# EAGLE design air (EAGLE 9.5.2)
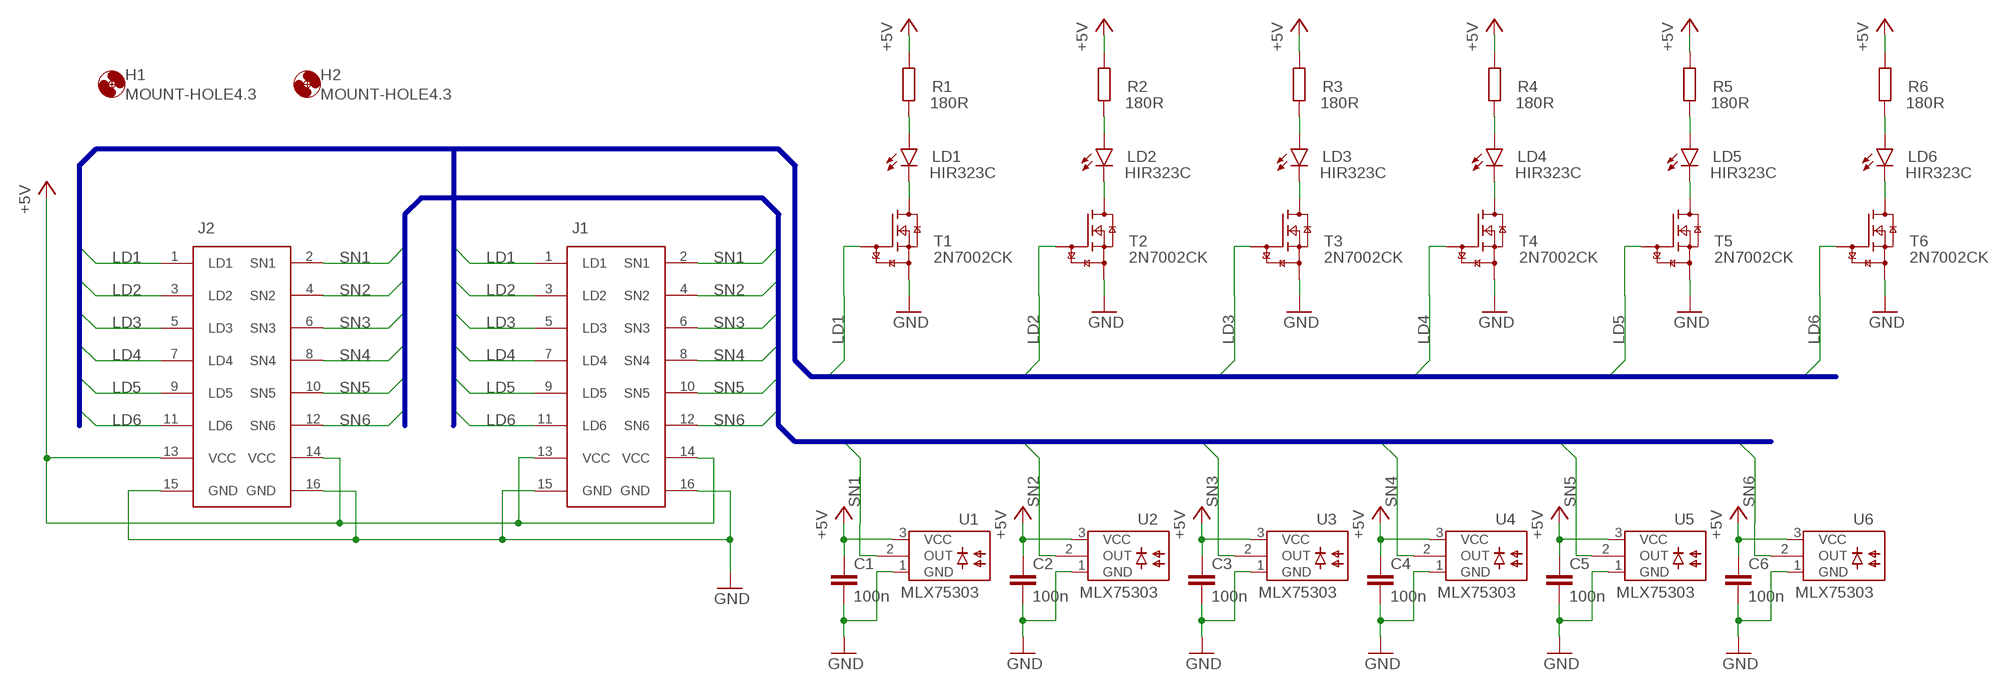
[diagram p0: schematic, sheet 1]

## Parts
C1  100n  C-EUC0805K  [C0805K]
C2  100n  C-EUC0805K  [C0805K]
C3  100n  C-EUC0805K  [C0805K]
C4  100n  C-EUC0805K  [C0805K]
C5  100n  C-EUC0805K  [C0805K]
C6  100n  C-EUC0805K  [C0805K]
H1  MOUNT-HOLE4.3  [4,3]
H2  MOUNT-HOLE4.3  [4,3]
J1  2516-SMD-AIR  [612X1620621]
J2  2516-SMD-AIR  [612X1620621]
LD1  HIR323C  [LEDRD254W60D590H600B]
LD2  HIR323C  [LEDRD254W60D590H600B]
LD3  HIR323C  [LEDRD254W60D590H600B]
LD4  HIR323C  [LEDRD254W60D590H600B]
LD5  HIR323C  [LEDRD254W60D590H600B]
LD6  HIR323C  [LEDRD254W60D590H600B]
R1  180R  R-EU_R0805  [R0805]
R2  180R  R-EU_R0805  [R0805]
R3  180R  R-EU_R0805  [R0805]
R4  180R  R-EU_R0805  [R0805]
R5  180R  R-EU_R0805  [R0805]
R6  180R  R-EU_R0805  [R0805]
T1  2N7002CK  [SOT23]
T2  2N7002CK  [SOT23]
T3  2N7002CK  [SOT23]
T4  2N7002CK  [SOT23]
T5  2N7002CK  [SOT23]
T6  2N7002CK  [SOT23]
U1  MLX75303  [SOIC127P600X147-8N]
U2  MLX75303  [SOIC127P600X147-8N]
U3  MLX75303  [SOIC127P600X147-8N]
U4  MLX75303  [SOIC127P600X147-8N]
U5  MLX75303  [SOIC127P600X147-8N]
U6  MLX75303  [SOIC127P600X147-8N]

## Nets
+5V: C1.1 C2.1 C3.1 C4.1 C5.1 C6.1 J1.13(VCC) J1.14(VCC) J2.13(VCC) J2.14(VCC) R1.2 R2.2 R3.2 R4.2 R5.2 R6.2 U1.3(VCC) U2.3(VCC) U3.3(VCC) U4.3(VCC) U5.3(VCC) U6.3(VCC)
GND: C1.2 C2.2 C3.2 C4.2 C5.2 C6.2 J1.15(GND) J1.16(GND) J2.15(GND) J2.16(GND) T1.2(S) T2.2(S) T3.2(S) T4.2(S) T5.2(S) T6.2(S) U1.1(GND) U2.1(GND) U3.1(GND) U4.1(GND) U5.1(GND) U6.1(GND)
LD1: J1.1(LD1) J2.1(LD1) T1.1(G)
LD2: J1.3(LD2) J2.3(LD2) T2.1(G)
LD3: J1.5(LD3) J2.5(LD3) T3.1(G)
LD4: J1.7(LD4) J2.7(LD4) T4.1(G)
LD5: J1.9(LD5) J2.9(LD5) T5.1(G)
LD6: J1.11(LD6) J2.11(LD6) T6.1(G)
N$1: LD1.1(A) R1.1
N$2: LD1.2(C) T1.3(D)
N$3: LD2.1(A) R2.1
N$4: LD2.2(C) T2.3(D)
N$5: LD3.1(A) R3.1
N$6: LD3.2(C) T3.3(D)
N$7: LD4.1(A) R4.1
N$8: LD4.2(C) T4.3(D)
N$9: LD5.1(A) R5.1
N$10: LD5.2(C) T5.3(D)
N$11: LD6.1(A) R6.1
N$12: LD6.2(C) T6.3(D)
SN1: J1.2(SN1) J2.2(SN1) U1.2(OUT)
SN2: J1.4(SN2) J2.4(SN2) U2.2(OUT)
SN3: J1.6(SN3) J2.6(SN3) U3.2(OUT)
SN4: J1.8(SN4) J2.8(SN4) U4.2(OUT)
SN5: J1.10(SN5) J2.10(SN5) U5.2(OUT)
SN6: J1.12(SN6) J2.12(SN6) U6.2(OUT)

## Buses
SN[1..6]
LD[1..6]

## Library data of the parts
C1-C6 = chuni:C-EU: CAPACITOR, European symbol; SPICEPREFIX: C
H1 H2 = chuni:MOUNT-HOLE: MOUNTING HOLE with drill center marker
J1 J2 = chuni:2516-SMD-AIR: WR-BHD 2.54mm Male SMT Box Header High Temperature, 16 Pins=>Code : Con_WTB_BHD_2.54_Male_SMT_612X1620621(X=0;X=3) <http://katalog.we-online.de/media/thumbs2/eican/thb_Con_WTB_BHD_2.54_Male_SMT_6120xx20621_pf2.jpg> 6123XX20621: http://katalog.we-online.de/en/em/BHD_2_54_SMT_MALE_BOX_HEADER_REEL_6123XX20621 6120XX20621: http://katalog.we-online.de/en/em/612_0xx_206_21 Created 2014-06-05, Karrer Zheng 2014 (C) Würth Elektronik
LD1-LD6 = chuni:HIR323C
R1-R6 = chuni:R-EU_: RESISTOR, European symbol; SPICEPREFIX: R
T1-T6 = chuni:2N7002CK: 60 V, 0.3 A N-channel Trench MOSFET ESD protected N-channel enhancement mode Field-Effect Transistor (FET) in a small SOT23 (TO-236AB) Surface-Mounted Device (SMD) plastic package using Trench MOSFET technology. AAL Eindhoven MK
U1-U6 = chuni:MLX75303

## Board
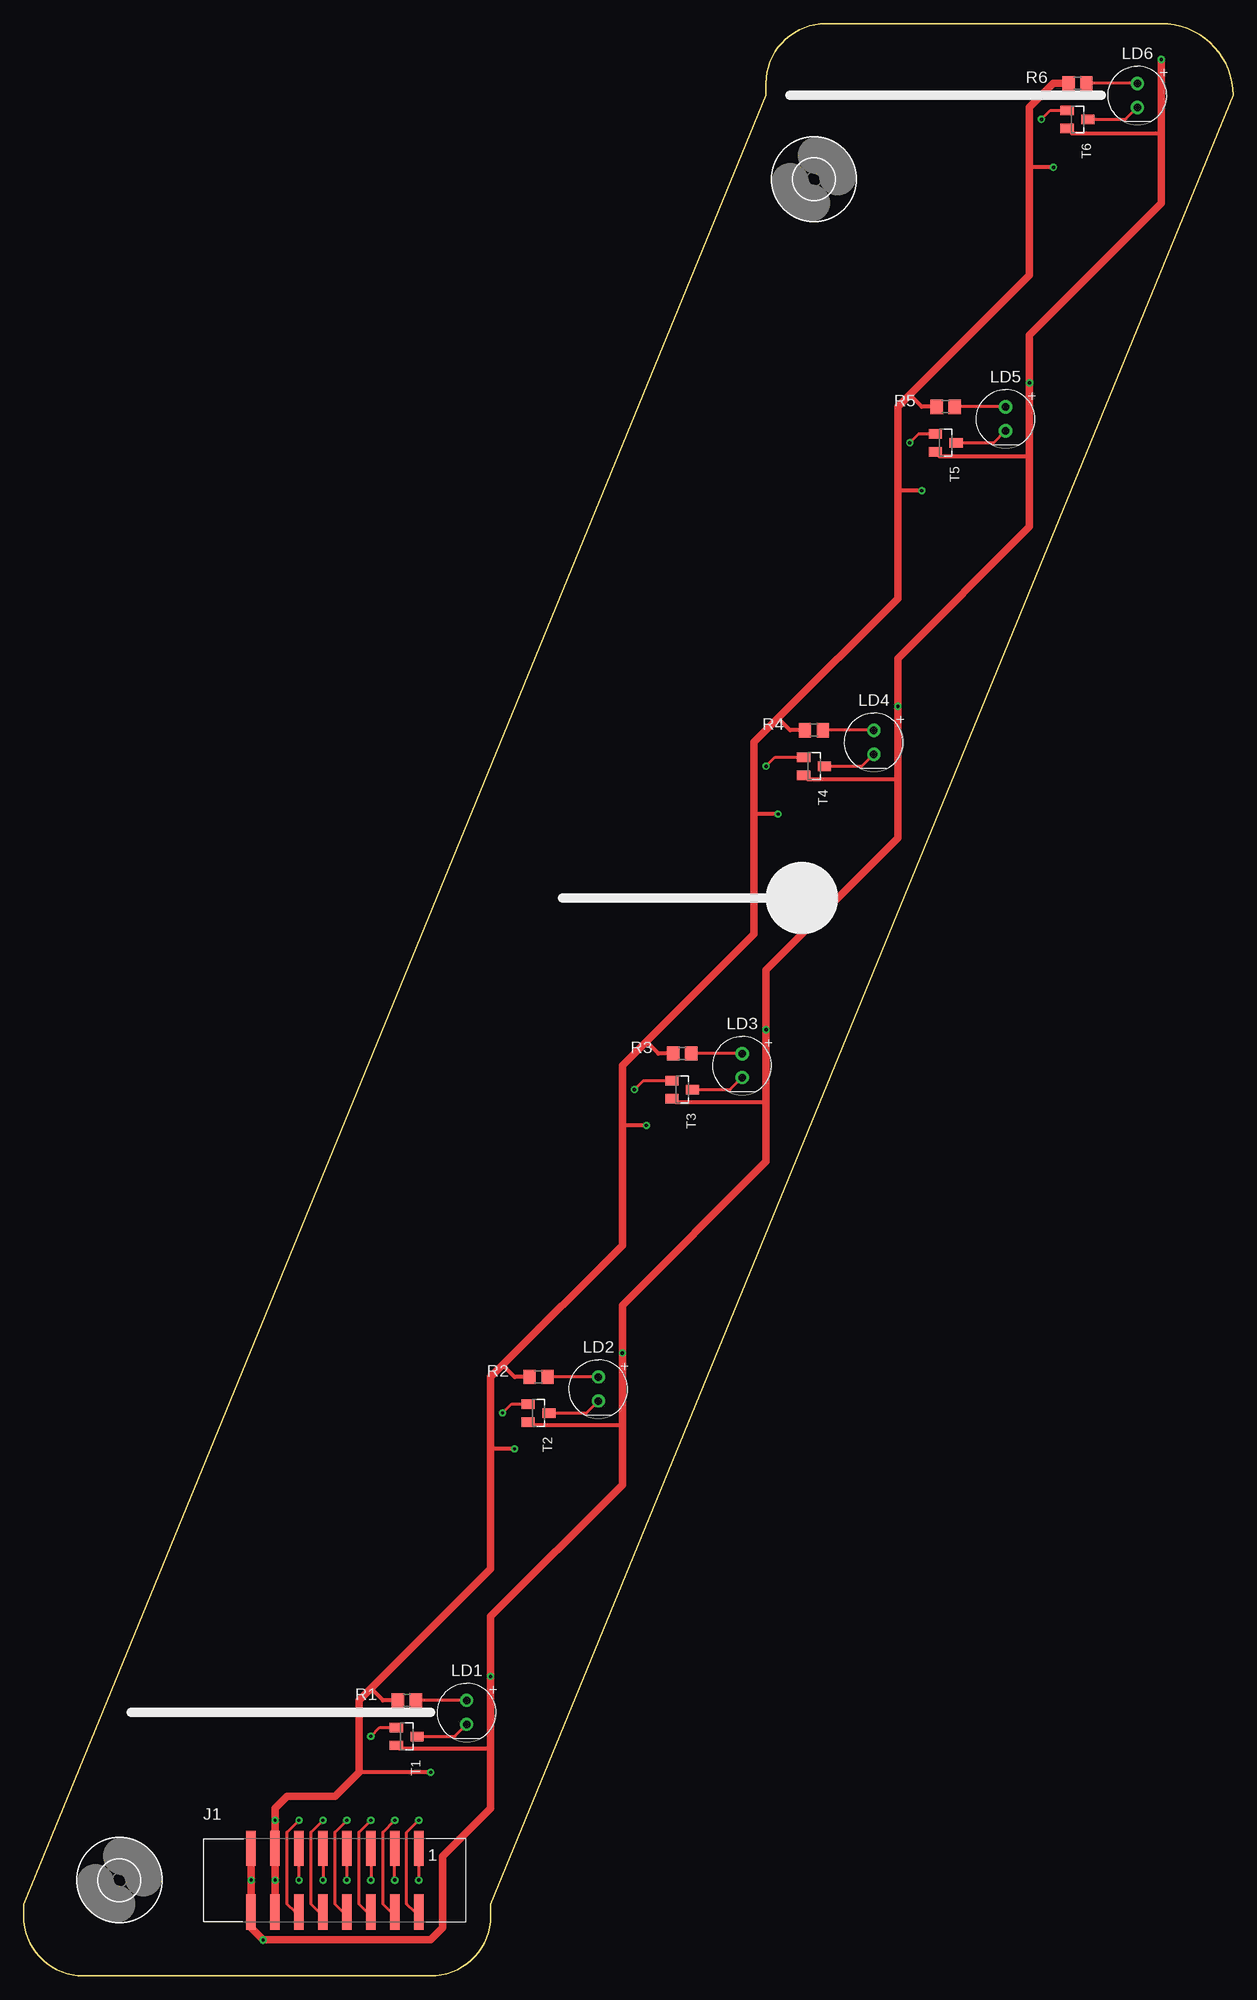
[diagram p1: board, top side]
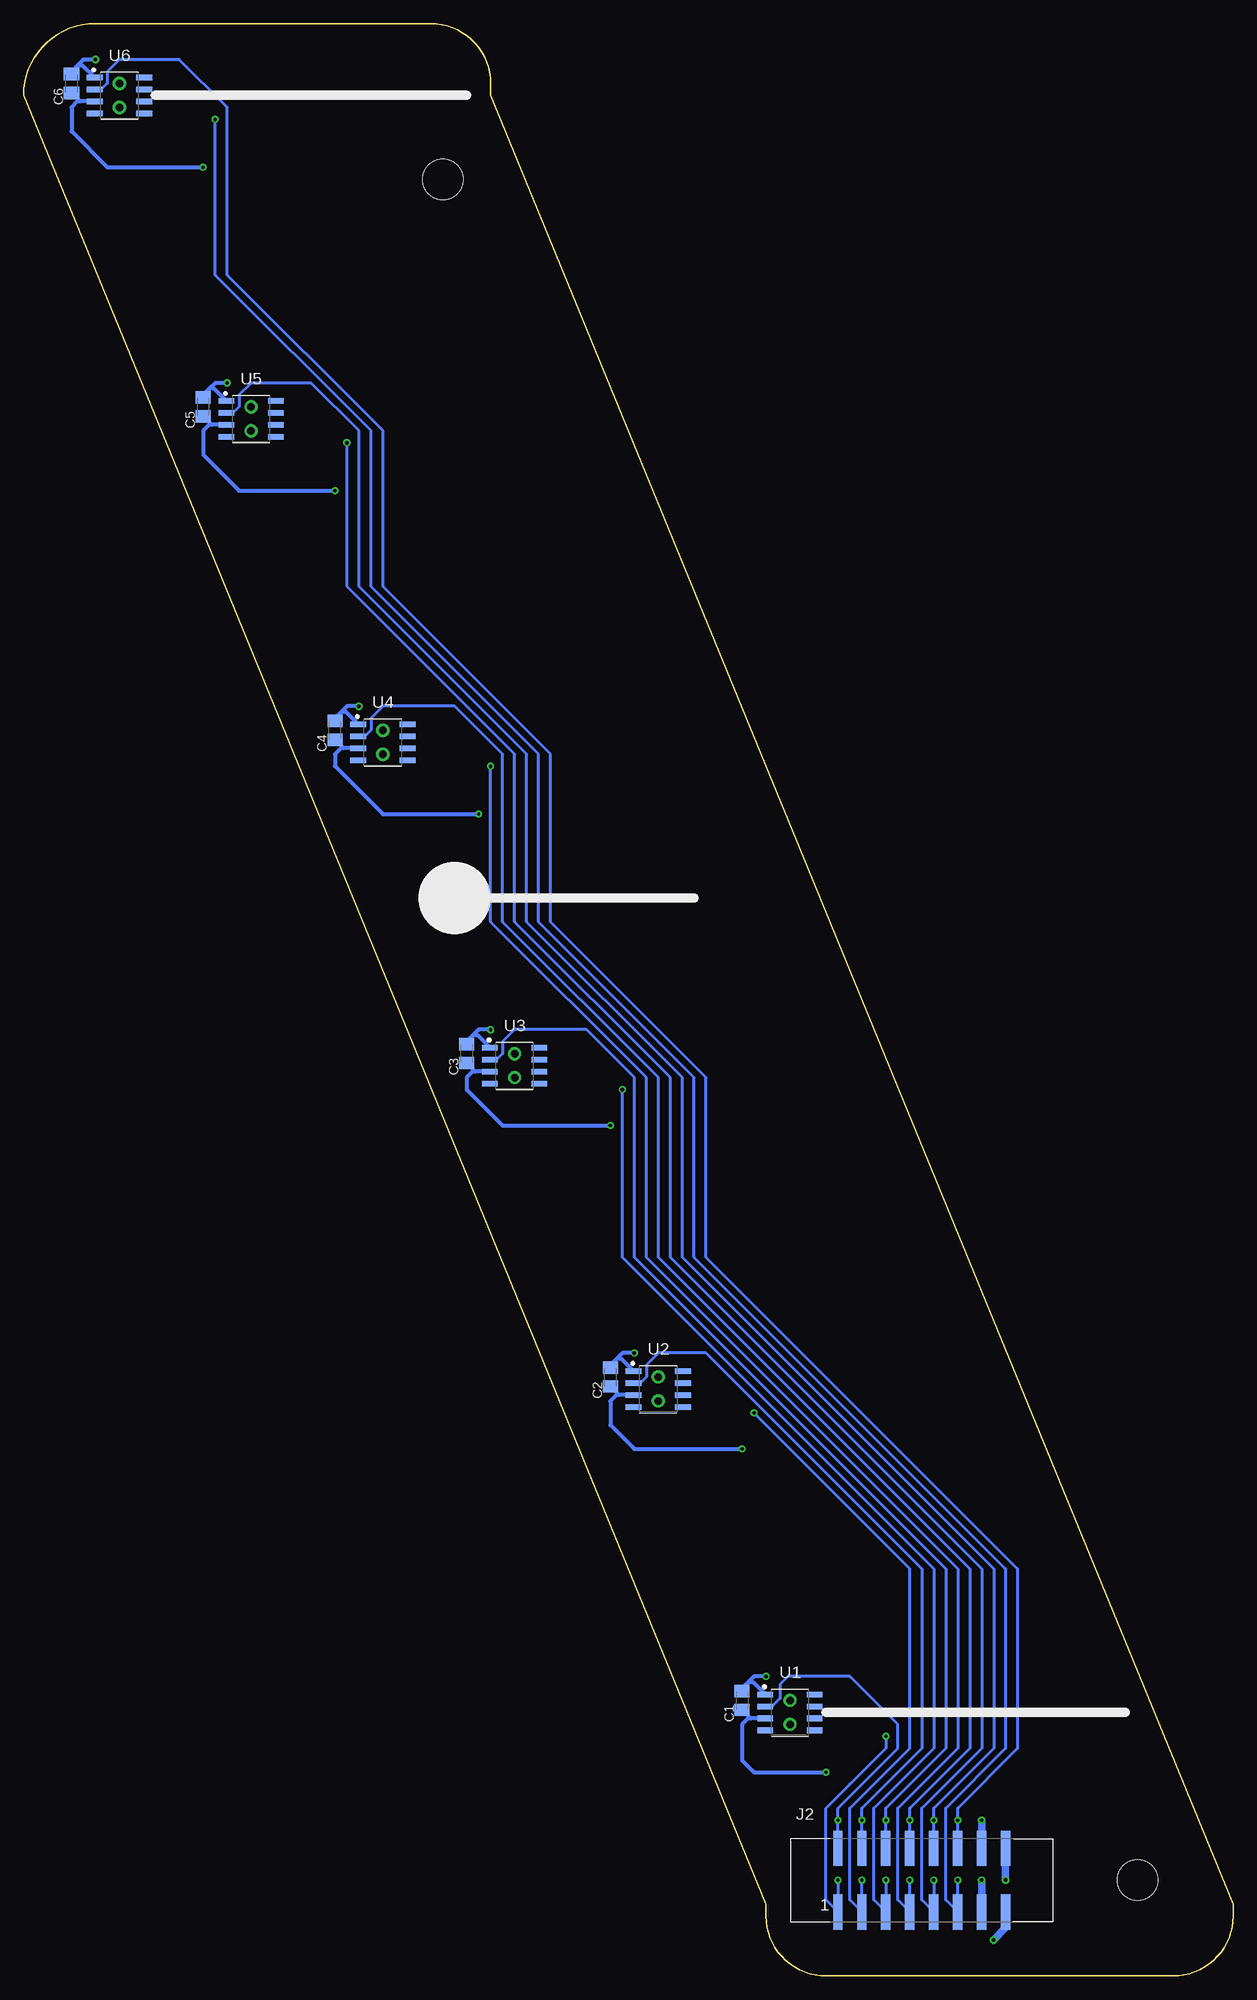
[diagram p2: board, bottom side, seen from below]

Size 128.27 x 207.01 mm. Coordinates in mm from the lower left corner, seen from the top.
Outline: 85.09,207.01 119.38,207.01 120.65,207.01 arc-90 128.27,199.39 49.53,7.62 49.53,6.35 arc-90 43.18,0 6.35,0 arc-90 0,6.35 0,7.62 78.74,199.39 78.74,200.66 arc-90 85.09,207.01
Copper layers (1*16): Top 0.035mm / dielectric 1.5mm / Bottom 0.035mm
Design rules "default *": minimum track width 6mil, minimum drill 0.35mm, track to track 8mil, track to pad 8mil, pad to pad 8mil, via to via 8mil, smd to smd 6mil, copper to edge 40mil, drill to drill 6mil, minimum pad ring 10mil, minimum via ring 8mil, stop-mask expansion 4mil, vias tented up to drill 0mil, thermal gap 10mil

### Footprints (pad centres in the part's own frame; a part is rotated, then mirrored left to right if it is on the bottom)
C0805K = smd 1.3 x 1.6: 1 -1,0; 2 1,0
4,3 = hole 4.3: 0,0
612X1620621 = smd 1 x 3.75: 1 -8.89,-3.375; 2 -8.89,3.375; 3 -6.35,-3.375; 4 -6.35,3.375; 5 -3.81,-3.375; 6 -3.81,3.375; 7 -1.27,-3.375; 8 -1.27,3.375; 9 1.27,-3.375; 10 1.27,3.375; 11 3.81,-3.375; 12 3.81,3.375; 13 6.35,-3.375; 14 6.35,3.375; 15 8.89,-3.375; 16 8.89,3.375
LEDRD254W60D590H600B = drill 0.8 pad 1.4: 1 -1.27,0; 2 1.27,0
R0805 = smd 1.3 x 1.5: 1 -0.95,0; 2 0.95,0
SOT23 = smd 1 x 1.4: 1 -0.95,-1.1; 2 0.95,-1.1; 3 0,1.1
SOIC127P600X147-8N = smd 1.665 x 0.602: 1 -2.625,1.905; 2 -2.625,0.635; 3 -2.625,-0.635; 4 -2.625,-1.905; 5 2.625,-1.905; 6 2.625,-0.635; 7 2.625,0.635; 8 2.625,1.905

### Placement (x,y rotation side)
C1  52.07,29.21 90 bottom
C2  66.04,63.5 90 bottom
C3  81.28,97.79 90 bottom
C4  95.25,132.08 90 bottom
C5  109.22,166.37 90 bottom
C6  123.19,200.66 90 bottom
H1  10.16,10.16 0 top
H2  83.82,190.5 0 top
J1  33.02,10.16 180 top
J2  33.02,10.16 0 bottom
LD1  46.99,27.94 270 top
LD2  60.96,62.23 270 top
LD3  76.2,96.52 270 top
LD4  90.17,130.81 270 top
LD5  104.14,165.1 270 top
LD6  118.11,199.39 270 top
R1  40.64,29.21 180 top
R2  54.61,63.5 180 top
R3  69.85,97.79 180 top
R4  83.82,132.08 180 top
R5  97.79,166.37 180 top
R6  111.76,200.66 180 top
T1  40.64,25.4 270 top
T2  54.61,59.69 270 top
T3  69.85,93.98 270 top
T4  83.82,128.27 270 top
T5  97.79,162.56 270 top
T6  111.76,196.85 270 top
U1  46.99,27.94 0 bottom
U2  60.96,62.23 0 bottom
U3  76.2,96.52 0 bottom
U4  90.17,130.81 0 bottom
U5  104.14,165.1 0 bottom
U6  118.11,199.39 0 bottom

### Tracks (layer width: path | path; a pad name or v marks a point on that pad's centre or on a via)
+5V  (via drill 0.35)
  Top 0.406: v109.22,191.77 106.68,191.77 | v95.25,157.48 92.71,157.48 | R4.2 81.28,132.08 80.01,133.35 | v80.01,123.19 77.47,123.19 | R3.2 67.31,97.79 66.04,99.06 | v66.04,90.17 63.5,90.17 | R2.2 52.07,63.5 50.8,64.77 | v52.07,55.88 49.53,55.88 | R1.2 38.1,29.21 36.83,30.48 | v43.18,21.59 35.56,21.59 | 93.98,167.64 95.25,166.37 R5.2
  Top 0.813: R6.2 109.22,200.66 106.68,198.12 106.68,191.77 106.68,180.34 93.98,167.64 92.71,166.37 92.71,157.48 92.71,146.05 80.01,133.35 77.47,130.81 77.47,123.19 77.47,110.49 66.04,99.06 63.5,96.52 63.5,90.17 63.5,77.47 50.8,64.77 49.53,63.5 49.53,55.88 49.53,43.18 36.83,30.48 35.56,29.21 35.56,21.59 33.02,19.05 27.94,19.05 26.67,17.78 v26.67,16.51 J1.13 v26.67,10.16 J2.13
  Bottom 0.406: v43.18,21.59 50.8,21.59 52.07,22.86 52.07,26.67 51.44,27.3 51.16,27.3 | U1.3 51.16,27.3 | v52.07,55.88 63.5,55.88 66.04,58.42 66.04,60.96 65.41,61.59 65.13,61.59 | U2.3 65.13,61.59 | v66.04,90.17 77.47,90.17 81.28,93.98 81.28,95.25 80.64,95.88 80.38,95.88 | U3.3 80.38,95.88 | v80.01,123.19 90.17,123.19 95.25,128.27 95.25,129.54 94.61,130.18 94.34,130.18 | U4.3 94.34,130.18 | v95.25,157.48 105.41,157.48 109.22,161.29 109.22,163.83 108.58,164.47 108.31,164.47 | U5.3 108.31,164.47 | U6.3 122.28,198.75 | 122.28,198.75 122.56,198.75 123.19,198.12 123.19,195.58 119.38,191.77 v109.22,191.77 | C6.1 122.28,198.75 | C5.1 108.31,164.47 | C4.1 94.34,130.18 | C3.1 80.38,95.88 | C2.1 65.13,61.59 | C1.1 51.16,27.3
  Bottom 0.813: J2.13 v26.67,10.16 | J1.13 v26.67,16.51
GND  (via drill 0.35)
  Top 0.406: T6.2 111.2,195.36 120.43,195.36 120.65,195.58 | T5.2 97.17,161.13 106.52,161.13 106.68,161.29 | T4.2 83.14,126.9 92.61,126.9 92.71,127 | T3.2 69.11,92.67 78.7,92.67 78.74,92.71 | 63.5,58.42 53.83,58.42 T2.2 | 49.53,24.13 39.86,24.13 T1.2
  Top 0.813: v120.65,203.2 120.65,195.58 120.65,187.96 106.68,173.99 v106.68,168.91 106.68,161.29 106.68,153.67 92.71,139.7 v92.71,134.62 92.71,127 92.71,120.65 78.74,106.68 v78.74,100.33 78.74,92.71 78.74,86.36 63.5,71.12 v63.5,66.04 63.5,58.42 63.5,52.07 49.53,38.1 v49.53,31.75 49.53,24.13 49.53,17.78 44.45,12.7 44.45,5.08 43.18,3.81 v25.4,3.81 24.13,5.08 J2.15 v24.13,10.16 J1.15
  Bottom 0.406: v120.65,203.2 121.92,203.2 122.56,202.56 | v106.68,168.91 107.95,168.91 108.58,168.28 | v92.71,134.62 93.98,134.62 94.61,133.99 | v78.74,100.33 80.01,100.33 80.64,99.69 | v63.5,66.04 64.77,66.04 65.41,65.41 | v49.53,31.75 50.8,31.75 51.44,31.12 | 122.56,202.56 123.19,201.93 C6.2 | 108.58,168.28 109.22,167.64 C5.2 | 94.61,133.99 95.25,133.35 C4.2 | 80.64,99.69 81.28,99.06 C3.2 | 65.41,65.41 66.04,64.77 C2.2 | 51.44,31.12 52.07,30.48 C1.2 | U6.1 122,202.56 122.56,202.56 | 108.58,168.28 108.03,168.28 U5.1 | U4.1 94.06,133.99 94.61,133.99 | 80.64,99.69 80.09,99.69 U3.1 | U2.1 64.86,65.41 65.41,65.41 | U1.1 50.88,31.12 51.44,31.12
  Bottom 0.813: J1.15 v24.13,10.16 | J2.15 24.13,5.08 v25.4,3.81
LD1  (via drill 0.35)
  Top 0.305: v36.83,25.4 37.78,26.35 T1.1 | J1.1 v41.91,10.16
  Bottom 0.305: v36.83,25.4 36.83,24.13 40.64,20.32 43.18,17.78 43.18,8.05 J2.1 v41.91,10.16
LD2  (via drill 0.35)
  Top 0.305: v50.8,59.69 51.75,60.64 T2.1 | v39.37,10.16 J1.3
  Bottom 0.305: v50.8,59.69 34.29,43.18 34.29,24.13 40.64,17.78 40.64,8.05 J2.3 v39.37,10.16
LD3  (via drill 0.35)
  Top 0.305: v64.77,93.98 65.72,94.93 T3.1 | J1.5 v36.83,10.16
  Bottom 0.305: v64.77,93.98 64.77,76.2 31.75,43.18 31.75,24.13 38.1,17.78 38.1,8.05 J2.5 v36.83,10.16
LD4  (via drill 0.35)
  Top 0.305: v78.74,128.27 79.69,129.22 T4.1 | v34.29,10.16 J1.7
  Bottom 0.305: v78.74,128.27 78.74,111.76 62.23,95.25 62.23,76.2 29.21,43.18 29.21,24.13 35.56,17.78 35.56,8.05 J2.7 v34.29,10.16
LD5  (via drill 0.35)
  Top 0.305: v93.98,162.56 94.93,163.51 T5.1 | J1.9 v31.75,10.16
  Bottom 0.305: v93.98,162.56 93.98,147.32 76.2,129.54 76.2,111.76 59.69,95.25 59.69,76.2 26.67,43.18 26.67,24.13 33.02,17.78 33.02,8.05 J2.9 v31.75,10.16
LD6  (via drill 0.35)
  Top 0.305: v107.95,196.85 108.9,197.8 T6.1 | v29.21,10.16 J1.11
  Bottom 0.305: v107.95,196.85 107.95,180.34 91.44,163.83 91.44,147.32 73.66,129.54 73.66,111.76 57.15,95.25 57.15,76.2 24.13,43.18 24.13,24.13 30.48,17.78 30.48,8.05 J2.11 v29.21,10.16
N$1
  Top 0.305: LD1.1 R1.1
N$2
  Top 0.305: T1.3 45.72,25.4 LD1.2
N$3
  Top 0.305: LD2.1 R2.1
N$4
  Top 0.305: T2.3 59.69,59.69 LD2.2
N$5
  Top 0.305: LD3.1 R3.1
N$6
  Top 0.305: T3.3 74.93,93.98 LD3.2
N$7
  Top 0.305: LD4.1 R4.1
N$8
  Top 0.305: T4.3 88.9,128.27 LD4.2
N$9
  Top 0.305: LD5.1 R5.1
N$10
  Top 0.305: T5.3 102.87,162.56 LD5.2
N$11
  Top 0.305: LD6.1 R6.1
N$12
  Top 0.305: T6.3 116.84,196.85 LD6.2
SN1  (via drill 0.35)
  Top 0.305: J1.2 41.48,6.79 40.64,7.62 40.64,15.24 v41.91,16.51
  Bottom 0.305: U1.2 48.9,28.57 48.05,29.42 48.05,30.92 47.21,31.75 40.64,31.75 35.56,26.67 35.56,24.13 41.91,17.78 v41.91,16.51 J2.2
SN2  (via drill 0.35)
  Top 0.305: J1.4 38.94,6.79 38.1,7.62 38.1,15.24 v39.37,16.51
  Bottom 0.305: U2.2 62.87,62.87 62.23,63.5 62.23,64.77 60.96,66.04 55.88,66.04 33.02,43.18 33.02,24.13 39.37,17.78 v39.37,16.51 J2.4
SN3  (via drill 0.35)
  Top 0.305: J1.6 36.39,6.79 35.56,7.62 35.56,15.24 v36.83,16.51
  Bottom 0.305: U3.2 78.11,97.16 77.47,97.79 77.47,99.06 76.2,100.33 68.58,100.33 63.5,95.25 63.5,76.2 30.48,43.18 30.48,24.13 36.83,17.78 v36.83,16.51 J2.6
SN4  (via drill 0.35)
  Top 0.305: J1.8 33.86,6.79 33.02,7.62 33.02,15.24 v34.29,16.51
  Bottom 0.305: U4.2 92.08,131.44 91.44,132.08 91.44,133.35 90.17,134.62 82.55,134.62 77.47,129.54 77.47,111.76 60.96,95.25 60.96,76.2 27.94,43.18 27.94,24.13 34.29,17.78 v34.29,16.51 J2.8
SN5  (via drill 0.35)
  Top 0.305: J1.10 31.32,6.79 30.48,7.62 30.48,15.24 v31.75,16.51
  Bottom 0.305: U5.2 106.05,165.74 105.41,166.37 105.41,167.64 104.14,168.91 97.79,168.91 92.71,163.83 92.71,147.32 74.93,129.54 74.93,111.76 58.42,95.25 58.42,76.2 25.4,43.18 25.4,24.13 31.75,17.78 v31.75,16.51 J2.10
SN6  (via drill 0.35)
  Top 0.305: J1.12 28.78,6.79 27.94,7.62 27.94,15.24 v29.21,16.51
  Bottom 0.305: U6.2 120.02,200.03 119.38,200.66 119.38,201.93 118.11,203.2 111.76,203.2 106.68,198.12 106.68,180.34 90.17,163.83 90.17,147.32 72.39,129.54 72.39,111.76 55.88,95.25 55.88,76.2 22.86,43.18 22.86,24.13 29.21,17.78 v29.21,16.51 J2.12